# EAGLE design sensor_board012 (EAGLE 5.07)

## Sheet 1 of 2
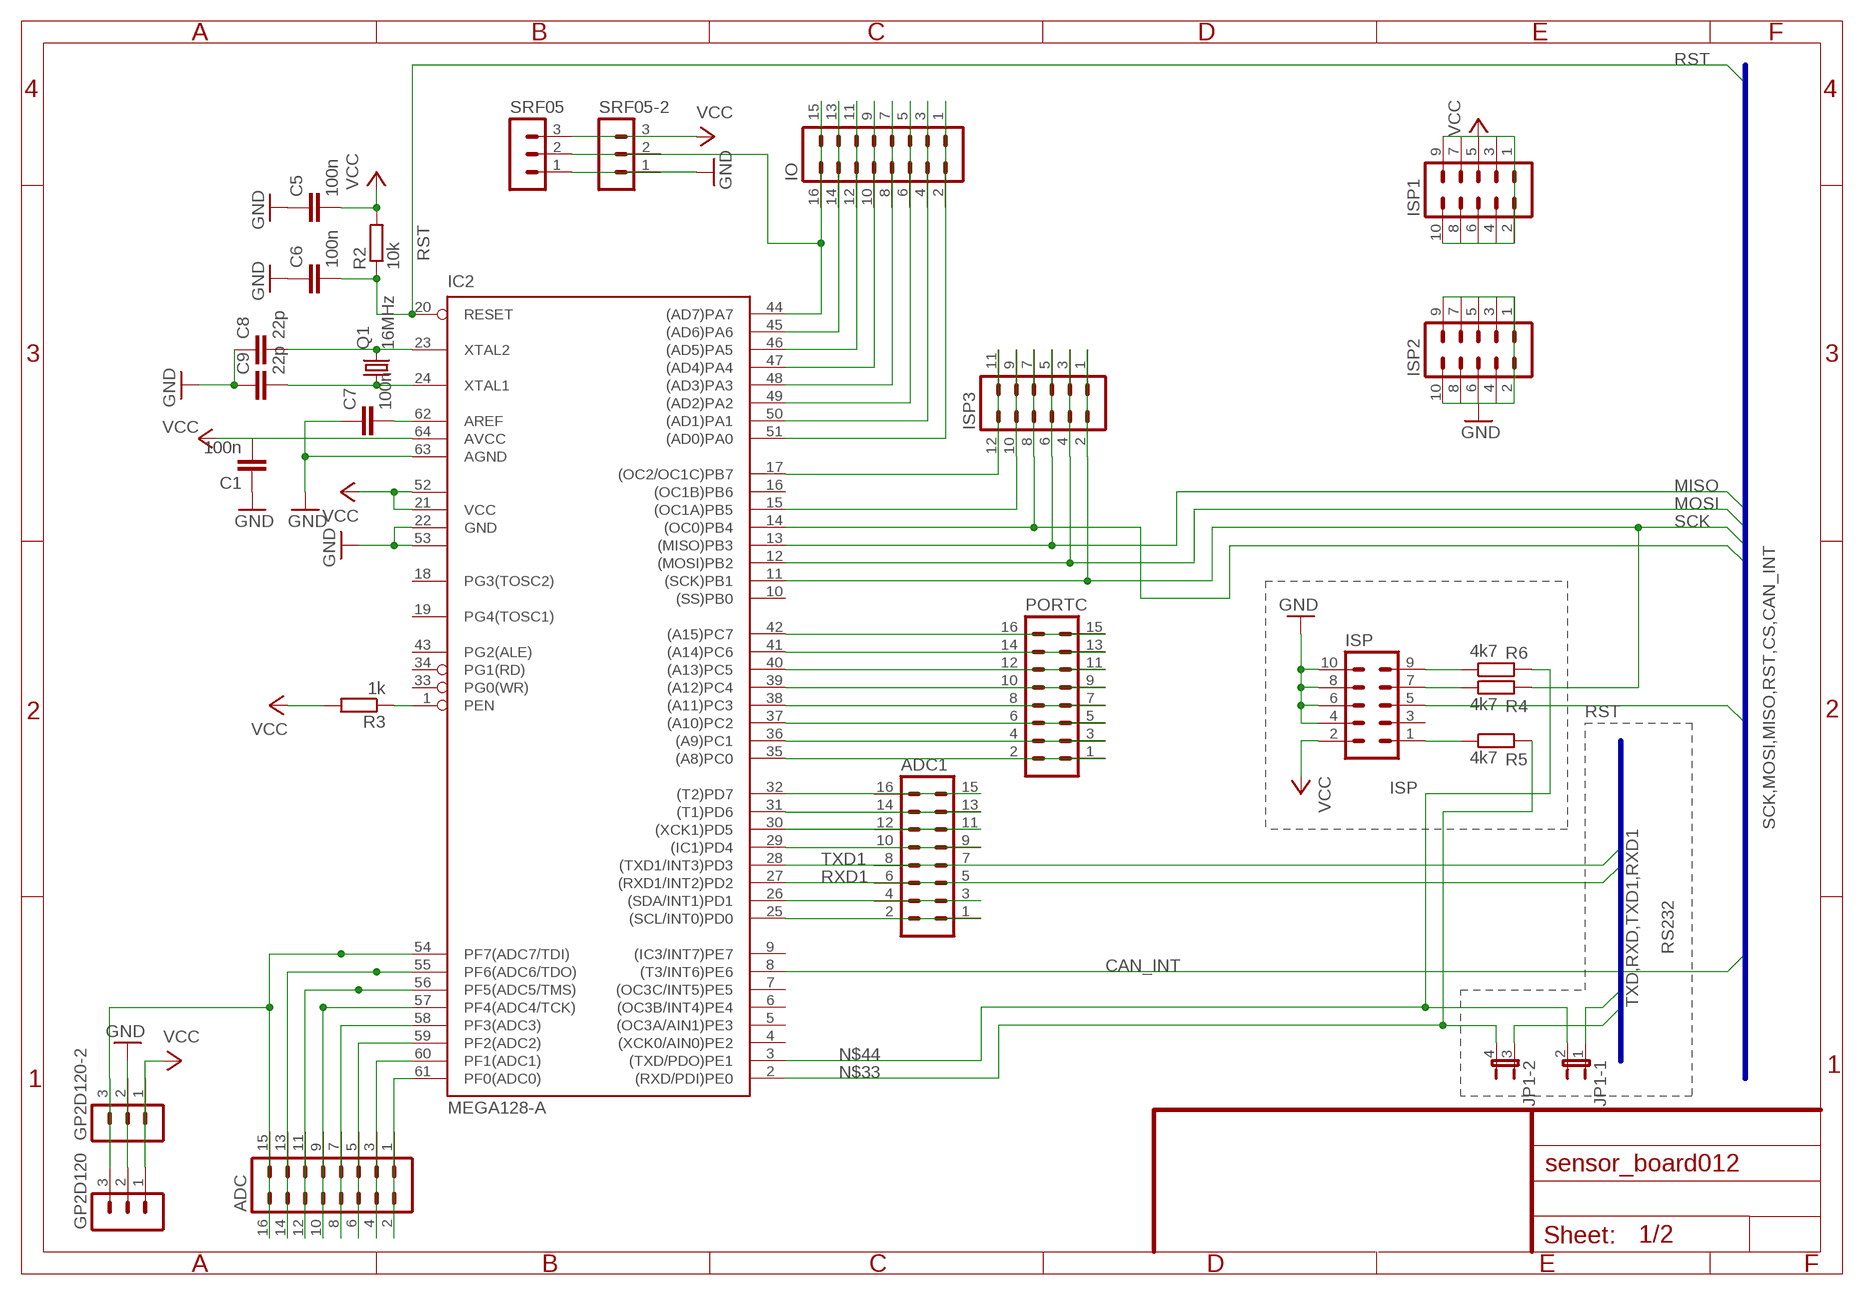
[diagram p0: schematic, sheet 1]

### Parts
ADC  MA08-2  [MA08-2]
ADC1  MA08-2  [MA08-2]
C1  100n  C-EUC0603  [C0603]
C5  100n  C-EUC0603  [C0603]
C6  100n  C-EUC0603  [C0603]
C7  100n  C-EUC0603  [C0603]
C8  22p  C-EUC0603  [C0603]
C9  22p  C-EUC0603  [C0603]
GP2D120  MA03-1  [MA03-1]
GP2D120-2  MA03-1  [MA03-1]
IC2  MEGA128-A  [TQFP64]
IO  MA08-2  [MA08-2]
ISP  MA05-2  [MA05-2]
ISP1  MA05-2  [MA05-2]
ISP2  MA05-2  [MA05-2]
ISP3  MA06-2  [MA06-2]
JP1  JP2QE  [JP2Q]
PORTC  MA08-2  [MA08-2]
Q1  16MHz  CRYSTALHC49U-V  [HC49U-V]
R2  10k  R-EU_R0805  [R0805]
R3  1k  R-EU_R0805  [R0805]
R4  4k7  R-EU_R0805  [R0805]
R5  4k7  R-EU_R0805  [R0805]
R6  4k7  R-EU_R0805  [R0805]
SRF05  MA03-1  [MA03-1]
SRF05-2  MA03-1  [MA03-1]

### Nets
CAN_INT: IC2.8((T3/INT6)PE6) ; also sheet 2
CS: IC2.14((OC0)PB4) ISP3.7 ISP3.8 ; also sheet 2
GND: C1.1 C5.1 C6.1 C7.1 C8.1 C9.1 GP2D120-2.2 GP2D120.2 IC2.22(GND) IC2.53(GND1) IC2.63(AGND) ISP2.1 ISP2.2 ISP2.3 ISP2.4 ISP2.5 ISP2.6 ISP2.7 ISP2.8 ISP2.9 ISP2.10 ISP.4 ISP.6 ISP.8 ISP.10 SRF05-2.1 SRF05.1 ; also sheet 2
MISO: IC2.13((MISO)PB3) ISP3.5 ISP3.6 ; also sheet 2
MOSI: IC2.12((MOSI)PB2) ISP3.3 ISP3.4 ; also sheet 2
N$1: ADC.1 ADC.2 IC2.61(PF0(ADC0))
N$3: ADC.3 ADC.4 IC2.60(PF1(ADC1))
N$4: ADC.5 ADC.6 IC2.59(PF2(ADC2))
N$5: C7.2 IC2.62(AREF)
N$6: C9.2 IC2.24(XTAL1) Q1.1
N$7: C8.2 IC2.23(XTAL2) Q1.2
N$9: ADC.7 ADC.8 IC2.58(PF3(ADC3))
N$11: ADC.9 ADC.10 IC2.57(PF4(ADC4/TCK))
N$14: ADC.11 ADC.12 IC2.56(PF5(ADC5/TMS))
N$15: ADC.13 ADC.14 IC2.55(PF6(ADC6/TDO))
N$19: ADC.15 ADC.16 GP2D120-2.3 GP2D120.3 IC2.54(PF7(ADC7/TDI))
N$20: IC2.45((AD6)PA6) IO.13 IO.14
N$22: ISP.9 R6.1
N$24: IC2.46((AD5)PA5) IO.11 IO.12
N$25: ISP.1 R5.1
N$26: IC2.1(PEN) R3.1
N$28: IC2.47((AD4)PA4) IO.9 IO.10
N$29: ISP.7 R4.1
N$31: IC2.48((AD3)PA3) IO.7 IO.8
N$32: IC2.49((AD2)PA2) IO.5 IO.6
N$33: IC2.2((RXD/PDI)PE0) JP1.4 R5.2
N$34: IC2.50((AD1)PA1) IO.3 IO.4
N$35: IC2.51((AD0)PA0) IO.1 IO.2
N$42: IC2.42((A15)PC7) PORTC.15 PORTC.16
N$44: IC2.3((TXD/PDO)PE1) JP1.2 R6.2
N$47: IC2.44((AD7)PA7) IO.15 IO.16 SRF05-2.2 SRF05.2
N$52: IC2.17((OC2/OC1C)PB7) ISP3.11 ISP3.12
N$60: IC2.15((OC1A)PB5) ISP3.9 ISP3.10
N$61: ADC1.1 ADC1.2 IC2.25((SCL/INT0)PD0)
N$62: ADC1.3 ADC1.4 IC2.26((SDA/INT1)PD1)
N$63: ADC1.9 ADC1.10 IC2.29((IC1)PD4)
N$64: ADC1.11 ADC1.12 IC2.30((XCK1)PD5)
N$65: ADC1.13 ADC1.14 IC2.31((T1)PD6)
N$66: ADC1.15 ADC1.16 IC2.32((T2)PD7)
N$67: IC2.41((A14)PC6) PORTC.13 PORTC.14
N$68: IC2.40((A13)PC5) PORTC.11 PORTC.12
N$69: IC2.39((A12)PC4) PORTC.9 PORTC.10
N$70: IC2.38((A11)PC3) PORTC.7 PORTC.8
N$71: IC2.37((A10)PC2) PORTC.5 PORTC.6
N$72: IC2.36((A9)PC1) PORTC.3 PORTC.4
N$73: IC2.35((A8)PC0) PORTC.1 PORTC.2
RST: C6.2 IC2.20(RESET) ISP.5 R2.1 ; also sheet 2
RXD: JP1.3 ; also sheet 2
RXD1: ADC1.5 ADC1.6 IC2.27((RXD1/INT2)PD2) ; also sheet 2
SCK: IC2.11((SCK)PB1) ISP3.1 ISP3.2 R4.2 ; also sheet 2
TXD: JP1.1 ; also sheet 2
TXD1: ADC1.7 ADC1.8 IC2.28((TXD1/INT3)PD3) ; also sheet 2
VCC: C1.2 C5.2 GP2D120-2.1 GP2D120.1 IC2.21(VCC) IC2.52(VCC1) IC2.64(AVCC) ISP1.1 ISP1.2 ISP1.3 ISP1.4 ISP1.5 ISP1.6 ISP1.7 ISP1.8 ISP1.9 ISP1.10 ISP.2 R2.2 R3.2 SRF05-2.3 SRF05.3 ; also sheet 2
Unconnected: IC2.4((XCK0/AIN0)PE2) IC2.5((OC3A/AIN1)PE3) IC2.6((OC3B/INT4)PE4) IC2.7((OC3C/INT5)PE5) IC2.9((IC3/INT7)PE7) IC2.10((SS)PB0) IC2.16((OC1B)PB6) IC2.18(PG3(TOSC2)) IC2.19(PG4(TOSC1)) IC2.33(PG0(WR)) IC2.34(PG1(RD)) IC2.43(PG2(ALE)) ISP.3

### Buses
SCK,MOSI,MISO,RST,CS,CAN_INT
TXD,RXD,TXD1,RXD1

### Notes on the sheet
- ISP
- RS232

## Sheet 2 of 2
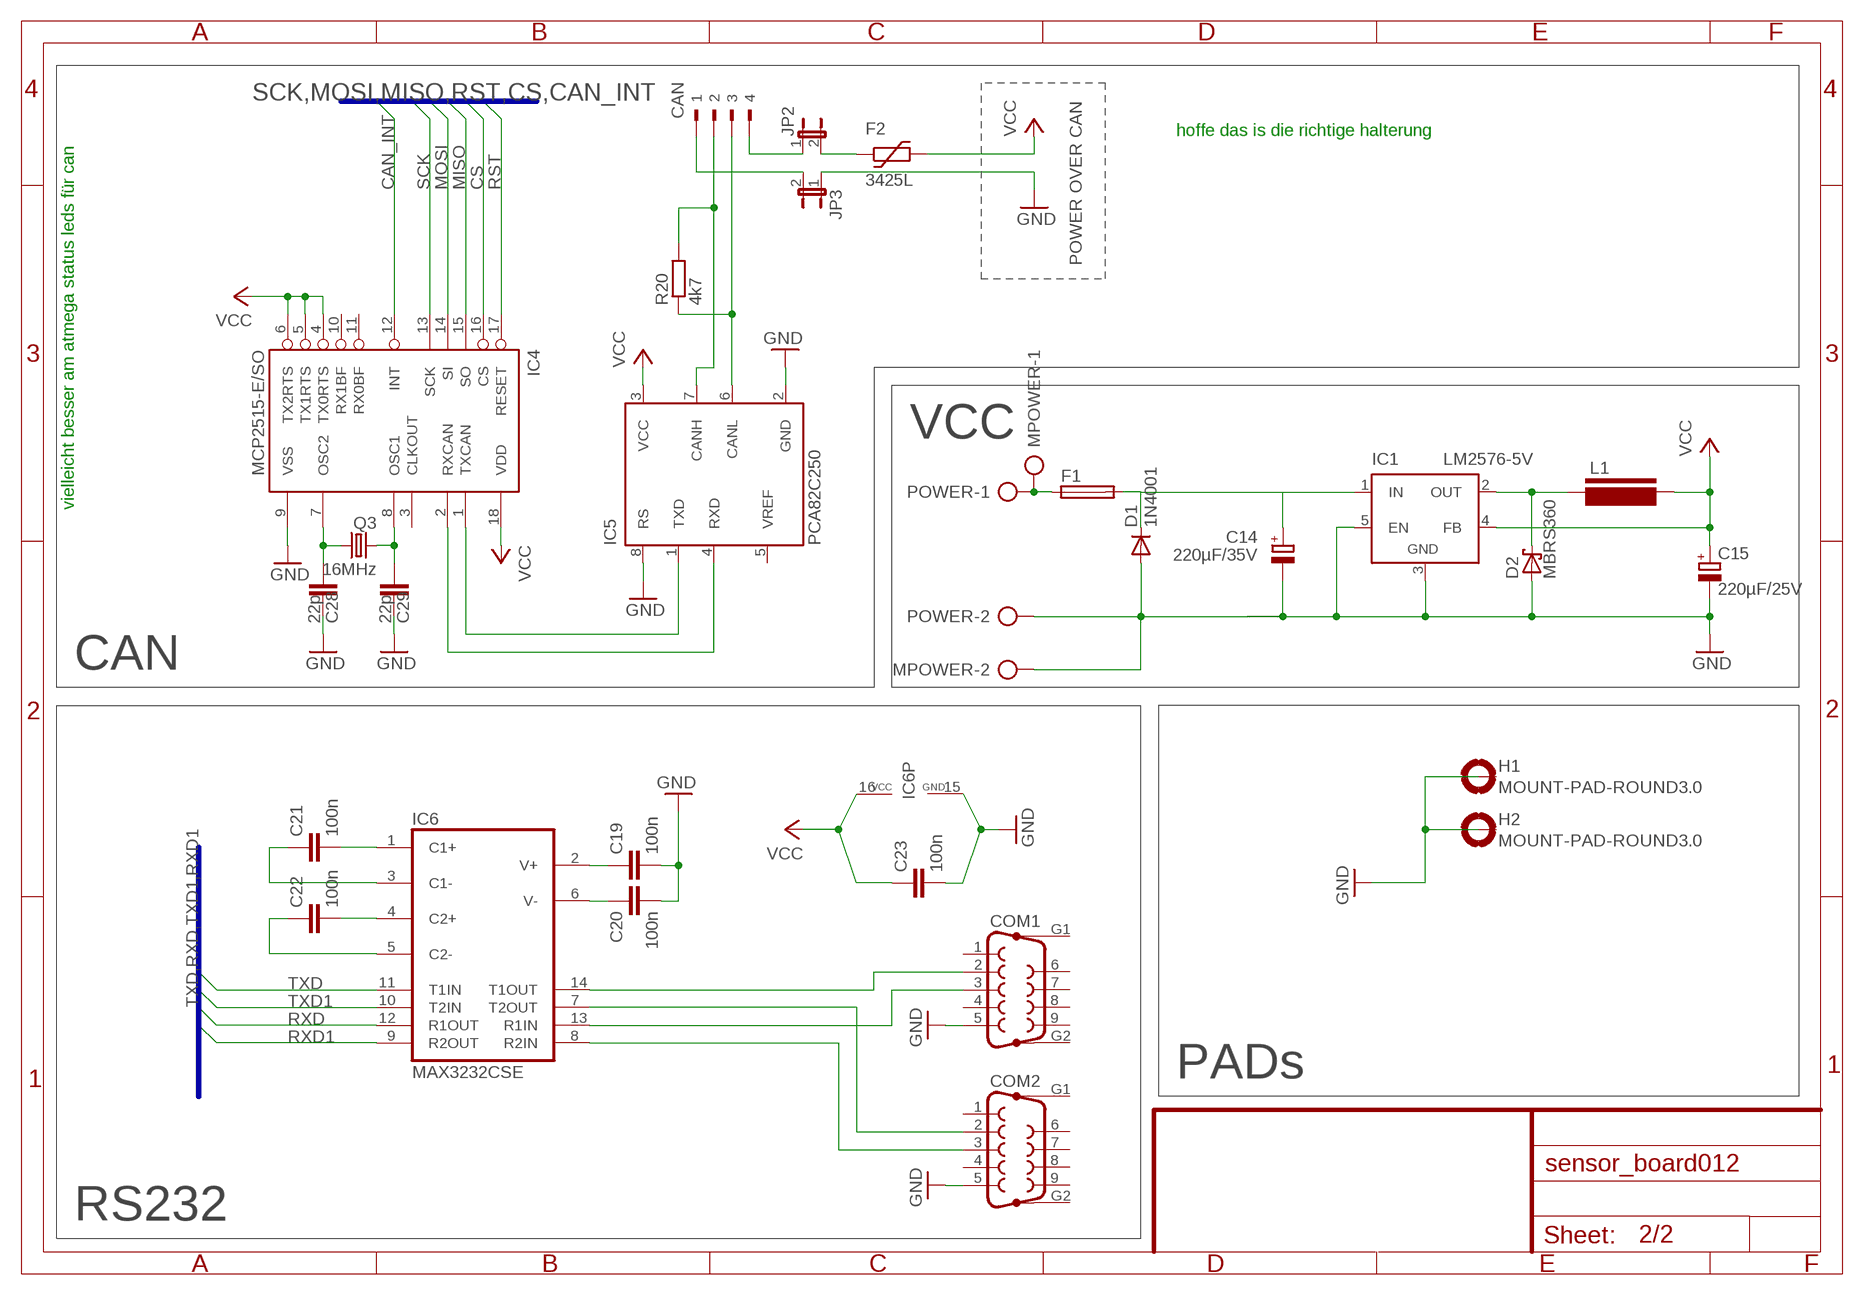
[diagram p1: schematic, sheet 2]

### Parts
C14  220µF/35V  CPOL-EUE5-10.5  [E5-10,5]
C15  220µF/25V  CPOL-EUE3.5-10  [E3,5-10]
C19  100n  C-EUC0603  [C0603]
C20  100n  C-EUC0603  [C0603]
C21  100n  C-EUC0603  [C0603]
C22  100n  C-EUC0603  [C0603]
C23  100n  C-EUC0603  [C0603]
C28  22p  C-EUC0603  [C0603]
C29  22p  C-EUC0603  [C0603]
CAN  90-4  [90-4]
COM1  F09HP  [F09HP]
COM2  F09HP  [F09HP]
D1  1N4001  1N4004  [DO41-10]
D2  MBRS360  SCHOTTKY-DIODESMC  [SMC]
F1  SH22,5A  [SH22,5A]
F2  3425L  [3425L]
H1  MOUNT-PAD-ROUND3.0  [3,0-PAD]
H2  MOUNT-PAD-ROUND3.0  [3,0-PAD]
IC1  LM2576-5V  LM2596TV  [TO220-51]
IC4  MCP2515-E/SO  [SO18L]
IC5  PCA82C250  [DIL08]
IC6  MAX3232CSE  [SO16]
JP2  JP1E  [JP1]
JP3  JP1E  [JP1]
L1  L-PISR  [PISR]
MPOWER  AK500/2-H  [AK500/2-H]
POWER  AK500/2-H  [AK500/2-H]
Q3  16MHz  CRYSTALHC49U-V  [HC49U-V]
R20  4k7  R-EU_R0805  [R0805]

### Nets
CAN_INT: IC4.12(INT) ; also sheet 1
CS: IC4.16(CS) ; also sheet 1
GND: C14.- C15.- C19.2 C20.2 C23.2 C28.2 C29.2 COM1.5 COM2.5 D1.A D2.A H1.B3,0(MOUNT) H2.B3,0(MOUNT) IC1.3(GND) IC1.5(EN) IC4.9(VSS) IC5.2(GND) IC5.8(RS) IC6.15(GND) JP3.1 MPOWER.2 POWER.2 ; also sheet 1
MISO: IC4.15(SO) ; also sheet 1
MOSI: IC4.14(SI) ; also sheet 1
N$2: IC4.1(TXCAN) IC5.1(TXD)
N$8 [Power]: D2.C IC1.2(OUT) L1.P$1
N$10 [Power]: F1.1 MPOWER.1 POWER.1
N$12: COM1.2 IC6.14(T1OUT)
N$13: COM1.3 IC6.13(R1IN)
N$16: CAN.4 JP2.1
N$17: C21.2 IC6.1(C1+)
N$21: IC4.2(RXCAN) IC5.4(RXD)
N$23: CAN.3 IC5.6(CANL) R20.1
N$30: C22.2 IC6.4(C2+)
N$36: C22.1 IC6.5(C2-)
N$37: C21.1 IC6.3(C1-)
N$40: COM2.2 IC6.7(T2OUT)
N$41: COM2.3 IC6.8(R2IN)
N$43: C19.1 IC6.2(V+)
N$46: C20.1 IC6.6(V-)
N$49: F2.P$1 JP2.2
N$50: CAN.1 JP3.2
N$53: C28.1 IC4.7(OSC2) Q3.1
N$54: C29.1 IC4.8(OSC1) Q3.2
N$56 [Power]: C14.+ D1.C F1.2 IC1.1(IN)
N$59: CAN.2 IC5.7(CANH) R20.2
RST: IC4.17(RESET) ; also sheet 1
RXD: IC6.12(R1OUT) ; also sheet 1
RXD1: IC6.9(R2OUT) ; also sheet 1
SCK: IC4.13(SCK) ; also sheet 1
TXD: IC6.11(T1IN) ; also sheet 1
TXD1: IC6.10(T2IN) ; also sheet 1
VCC: C15.+ C23.1 F2.P$2 IC1.4(FB) IC4.4(TX0RTS) IC4.5(TX1RTS) IC4.6(TX2RTS) IC4.18(VDD) IC5.3(VCC) IC6.16(VCC) L1.P$2 ; also sheet 1
Unconnected: COM1.1 COM1.4 COM1.6 COM1.7 COM1.8 COM1.9 COM1.G1 COM1.G2 COM2.1 COM2.4 COM2.6 COM2.7 COM2.8 COM2.9 COM2.G1 COM2.G2 IC4.3(CLKOUT) IC4.10(RX1BF) IC4.11(RX0BF) IC5.5(VREF)

### Buses
SCK,MOSI,MISO,RST,CS,CAN_INT
TXD,RXD,TXD1,RXD1

### Notes on the sheet
- POWER OVER CAN
- hoffe das is die richtige halterung
- VCC
- vielleicht besser am atmega status leds für can
- CAN
- PADs
- RS232

## Library data of the parts
ADC ADC1 IO PORTC = con-lstb:MA08-2: PIN HEADER
C1 C5-C9 C19-C23 C28 C29 = rcl:C-EU: CAPACITOR, European symbol
C14 C15 = rcl:CPOL-EU: POLARIZED CAPACITOR, European symbol
CAN = con-weidmueller-sl35:90-4: WEIDMUELLER CLAMP CONNECTOR
COM1 COM2 = con-subd:F09HP: SUB-D
D1 = diode:1N4004: DIODE general purpose rectifier, 1 A
D2 = diode:SCHOTTKY-DIODE: Schottky Diode
F1 = fuse:SH22,5A: FUSE HOLDER grid 22,5mm, isolated cap OGN0031 8201, Schurter (Buerklin)
F2 = ptc-littlefuse:3425L
GP2D120 GP2D120-2 SRF05 SRF05-2 = con-lstb:MA03-1: PIN HEADER
H1 H2 = holes:MOUNT-PAD-ROUND: MOUNTING PAD, round
IC1 = linear:LM2596T: STEP-DOWN VOLTAGE REGULATOR
IC2 = atmel:MEGA128: MICROCONTROLLER 128 Kbytes FLASH 4 Kbytes SRAM 4 Kbytes EEPROM DUAL USART 8-channel 10 bit ADC Source: avr.lbr
IC4 = mcp2515:MCP2515
IC5 = micro-philips:PCA82C250: CAN CONTROLLER INTERFACE
IC6 = maxim:MAX3232*: True RS-232 Transceivers 3.0V to 5.5V, Low-Power up to 1Mbps, Using Four 0.1µF External Capacitors Source: http://pdfserv.maxim-ic.com/en/ds/MAX3222-MAX3241.pdf
ISP ISP1 ISP2 = con-lstb:MA05-2: PIN HEADER
ISP3 = con-lstb:MA06-2: PIN HEADER
JP1 = jumper:JP2QE: JUMPER
JP2 JP3 = jumper:JP1E: JUMPER
L1 = L-PISR:L-PISR: Fastron SMD Power Inductors (also Shielded) - PISR Series Data Sheet <http://www.fastrongroup.com/products/inductors/pdf/PISR.pdf> Part No Inductance L (µH) fL (MHz) Tol ± (%) SRF min (MHz) DCR max (Ω) Rated DC Current | sat (A) | Δ T = 40°C (A) PISR-1R0M-04 1.0 0.1 20 164 0.009 21 8.60 PISR-2R2M-04 2.2 0.1 20 95 0.014 16 7.10 PISR-3R3M-04 3.3 0.1 20 72 0.017 15 6.40 PISR-4R7M-04 4.7 0.1 20 52 0.019 13 5.80 PISR-5R6M-04 5.6 0.1 20 41 0.022 12 5.50 PISR-6R8M-04 6.8 0.1 20 35 0.024 11 5.20 PISR-100M-04 10 0.1 20 24 0.029 10 4.50 PISR-150M-04 15 0.1 20 20 0.035 8.0 4.10 PISR-220M-04 22 0.1 20 15 0.04 7.0 3.60 PISR-330M-04 33 0.1 20 10 0.06 5.6 3.10 PISR-470M-04 47 0.1 20 8 0.07 4.6 2.70 PISR-680M-04 68 0.1 20 6.5 0.10 3.6 2.30 PISR-101M-04 100 0.1 20 5.2 0.17 3.1 1.90 PISR-151M-04 150 0.1 20 4.2 0.22 2.6 1.60 PISR-221M-04 220 0.1 20 3.3 0.34 2.2 1.30 PISR-331M-04 330 0.1 20 2.7 0.52 1.9 1.10 PISR-471M-04 470 0.1 20 2.1 0.76 1.4 0.85 PISR-681M-04 680 0.1 20 1.8 1.1 1.2 0.74 PISR-102M-04 1000 0.1 20 1.3 1.7 1.0 0.57
MPOWER POWER = con-ptr500:AK500/2-H: CONNECTOR Aug. 2004 / PTR Meßtechnik: Die Bezeichnung der Serie AK505 wurde geändert. Es handelt sich hierbei um AK500 in horizontaler Ausführung.
Q1 Q3 = crystal:CRYSTAL: CRYSTAL
R2-R6 R20 = rcl:R-EU_: RESISTOR, European symbol

## Net classes
1 Power: width 0.406 mm

## Board
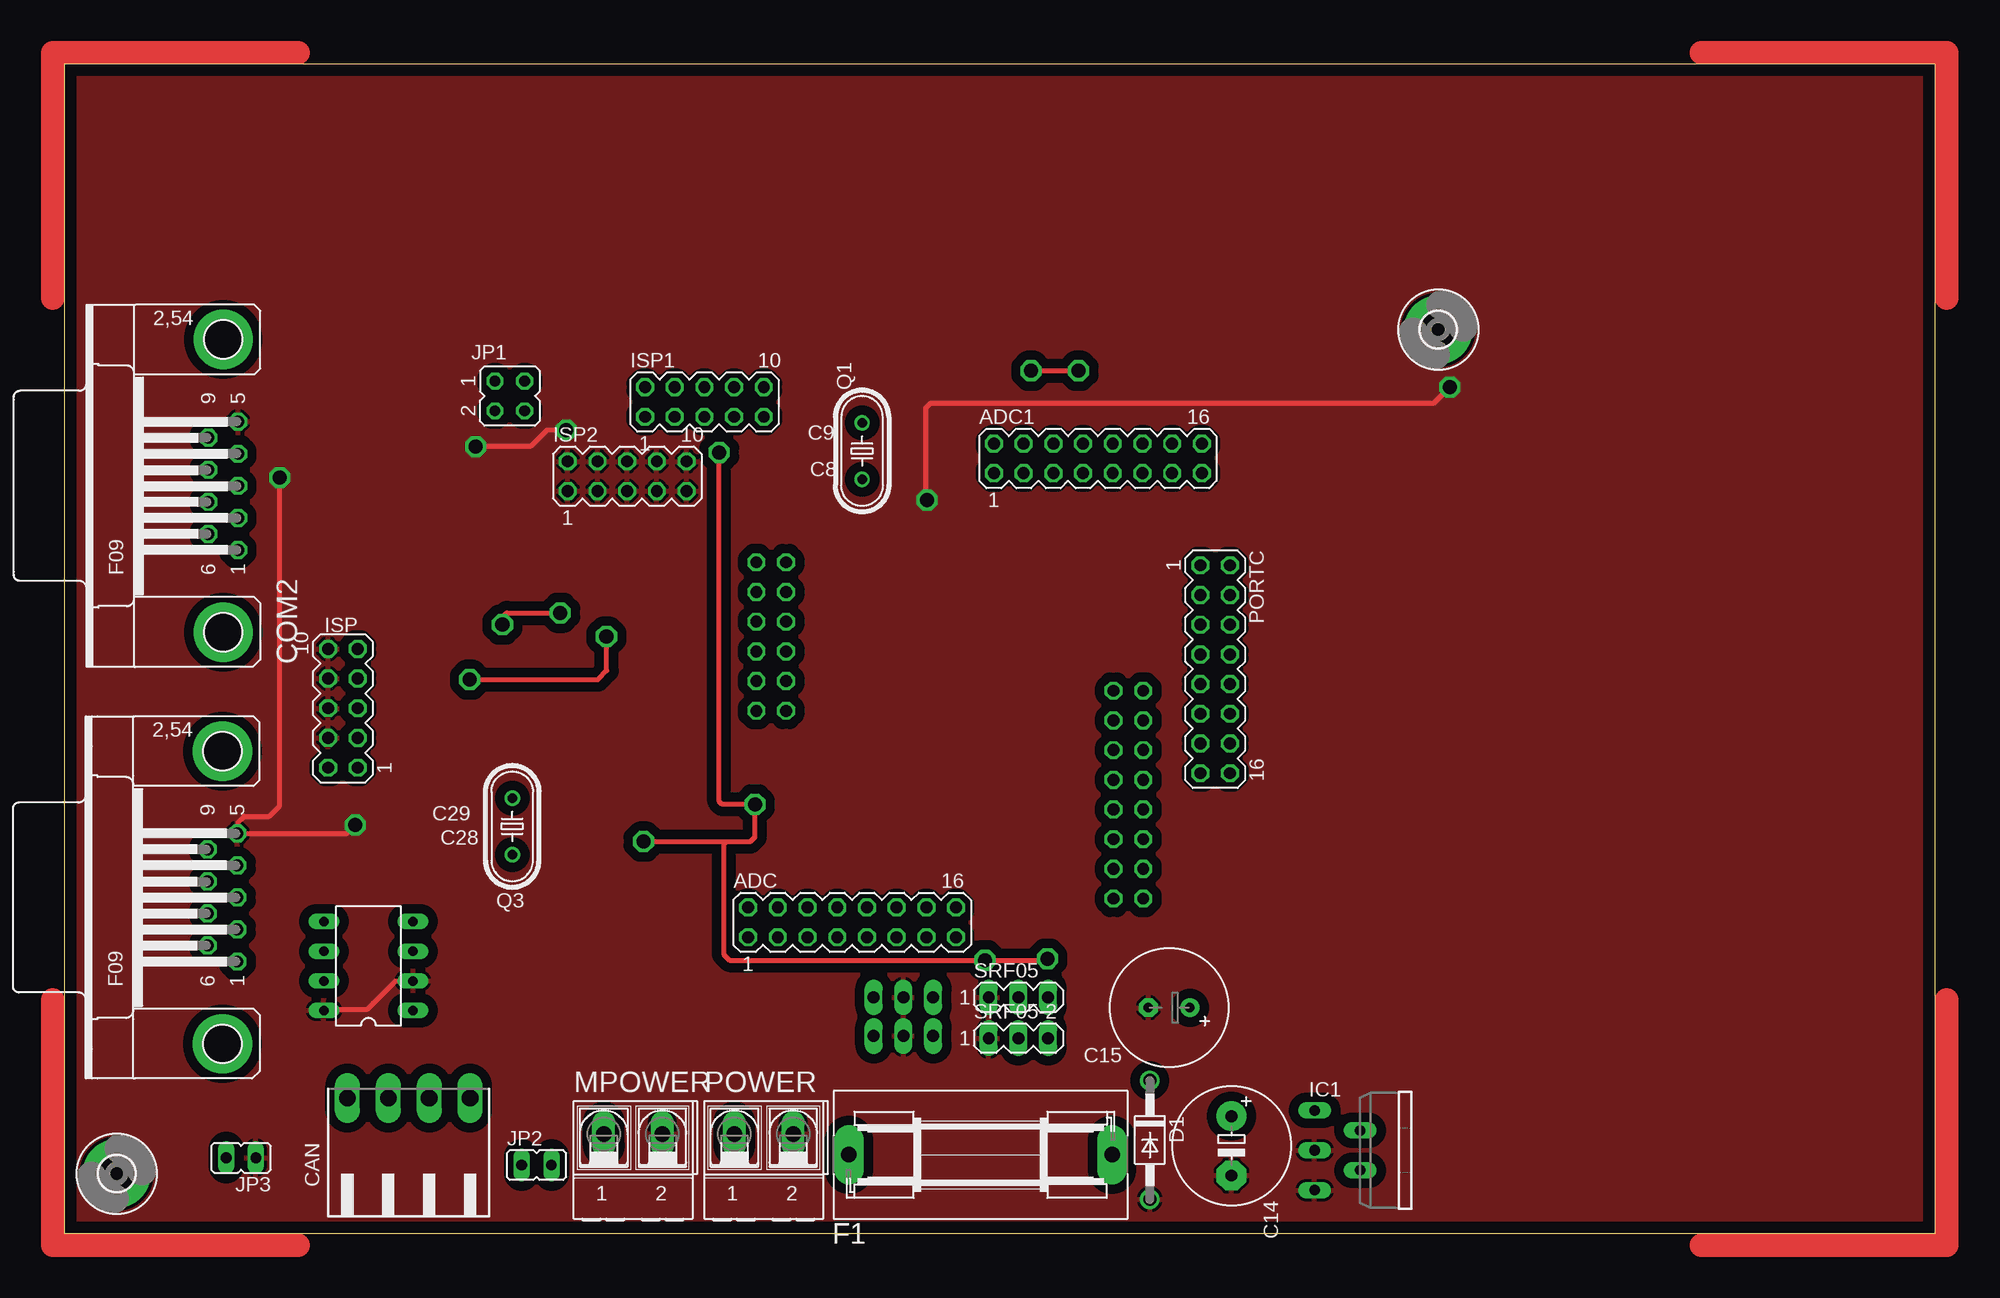
[diagram p2: board, top side]
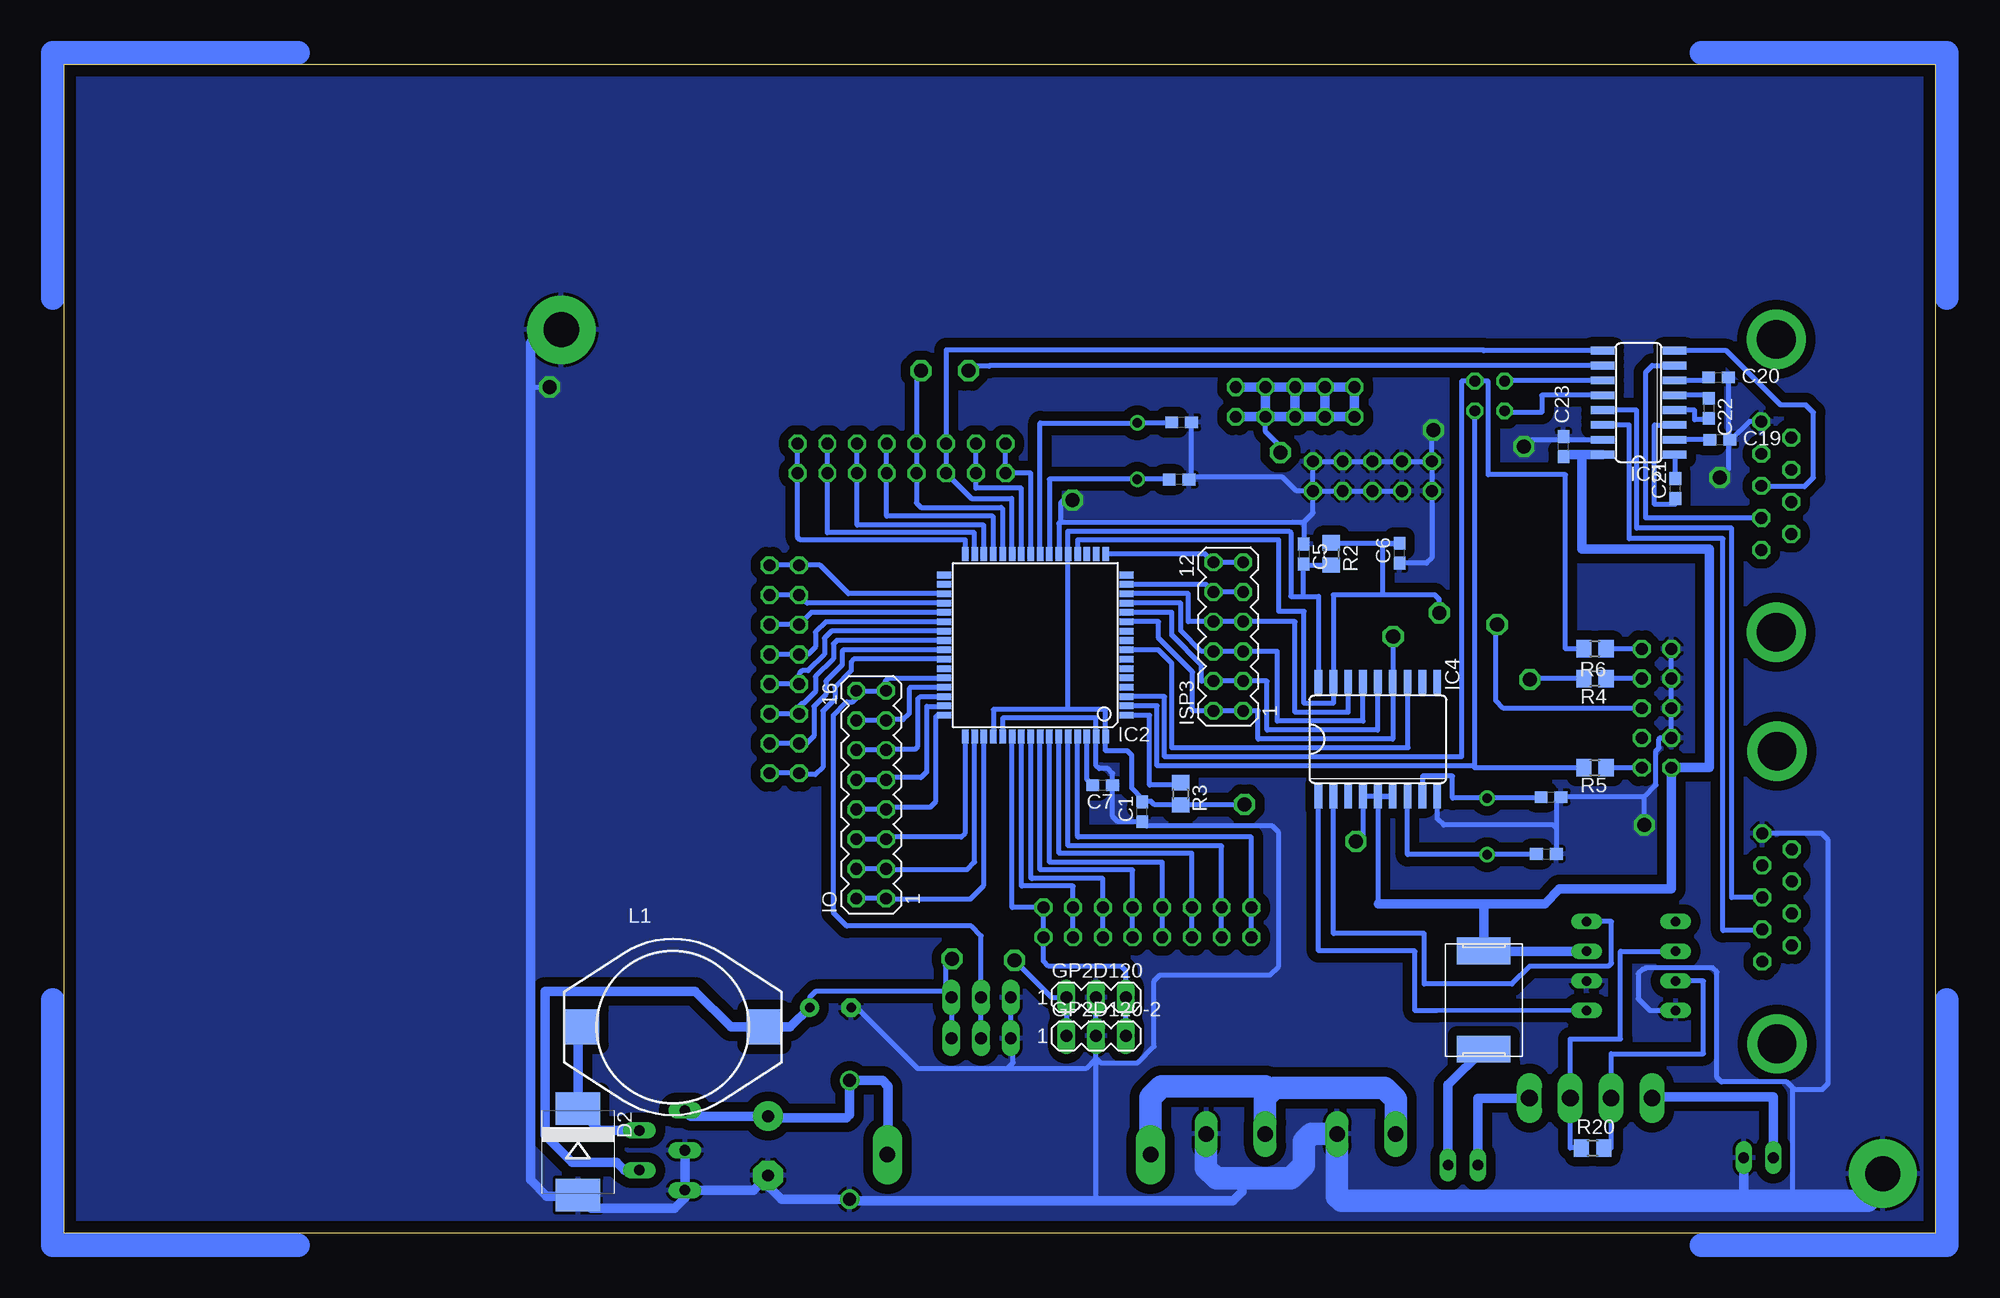
[diagram p3: board, bottom side, seen from below]

Size 160 x 100 mm. Coordinates in mm from the lower left corner, seen from the top.
Outline: 0,0 160,0 160,100 0,100 0,0
Copper layers (1*16): Top 0.035mm / dielectric 1.5mm / Bottom 0.035mm
Design rules "default": minimum track width 10mil, minimum drill 24mil, track to track 8mil, track to pad 8mil, pad to pad 8mil, via to via 8mil, smd to smd 8mil, copper to edge 40mil, drill to drill 8mil, minimum pad ring 10mil, minimum via ring 8mil, stop-mask expansion 4mil, vias tented up to drill 0mil, thermal gap 10mil

### Footprints (pad centres in the part's own frame; a part is rotated, then mirrored left to right if it is on the bottom)
MA08-2 = drill 1.016 octagon: 1 -8.89,-1.27; 2 -8.89,1.27; 3 -6.35,-1.27; 4 -6.35,1.27; 5 -3.81,-1.27; 6 -3.81,1.27; 7 -1.27,-1.27; 8 -1.27,1.27; 9 1.27,-1.27; 10 1.27,1.27; 11 3.81,-1.27; 12 3.81,1.27; 13 6.35,-1.27; 14 6.35,1.27; 15 8.89,-1.27; 16 8.89,1.27
C0603 = smd 1.1 x 1: 1 -0.85,0; 2 0.85,0
E5-10,5 = drill 1.016 pad 2.54 round: + -2.54,0 | drill 1.016 pad 2.54 octagon: - 2.54,0
E3,5-10 = drill 0.813 pad 1.6 round: + -1.778,0 | drill 0.813 pad 1.6 octagon: - 1.778,0
90-4 = drill 1.422 long: 1 -5.25,5.25; 2 -1.75,5.25; 3 1.75,5.25; 4 5.25,5.25
F09HP = drill 1.016 octagon: 1 -5.486,-1.27; 2 -2.743,-1.27; 3 0,-1.27; 4 2.743,-1.27; 5 5.486,-1.27; 6 -4.115,1.27; 7 -1.372,1.27; 8 1.372,1.27; 9 4.115,1.27 | drill 3.302 pad 5.08 round: G1 -12.522,0; G2 12.522,0
DO41-10 = drill 1.118 round: A 5.08,0; C -5.08,0
SMC = smd 2.8 x 3.8: A 3.7,0; C -3.7,0
SH22,5A = drill 1.321 pad 2.54 long: 1 -11.252,0; 2 11.252,0
3425L = smd 2.29 x 4.57: P$1 -4.2,0; P$2 4.2,0
MA03-1 = drill 1.016 long: 1 -2.54,0; 2 0,0; 3 2.54,0
3,0-PAD = drill 3 pad 5.842 round: B3,0 0,0
TO220-51 = drill 0.9 long: 1 -3.4,-8.4; 2 -1.7,-4.5; 3 0,-8.4; 4 1.7,-4.5; 5 3.4,-8.4
TQFP64 = smd 1.194 x 0.559: 1 -7.8,6; 2 -7.8,5.2; 3 -7.8,4.4; 4 -7.8,3.6; 5 -7.8,2.8; 6 -7.8,2; 7 -7.8,1.2; 8 -7.8,0.4; 9 -7.8,-0.4; 10 -7.8,-1.2; 11 -7.8,-2; 12 -7.8,-2.8; 13 -7.8,-3.6; 14 -7.8,-4.4; 15 -7.8,-5.2; 16 -7.8,-6; 33 7.8,-6; 34 7.8,-5.2; 35 7.8,-4.4; 36 7.8,-3.6; 37 7.8,-2.8; 38 7.8,-2; 39 7.8,-1.2; 40 7.8,-0.4; 41 7.8,0.4; 42 7.8,1.2; 43 7.8,2; 44 7.8,2.8; 45 7.8,3.6; 46 7.8,4.4; 47 7.8,5.2; 48 7.8,6 | smd 0.559 x 1.194: 17 -6,-7.8; 18 -5.2,-7.8; 19 -4.4,-7.8; 20 -3.6,-7.8; 21 -2.8,-7.8; 22 -2,-7.8; 23 -1.2,-7.8; 24 -0.4,-7.8; 25 0.4,-7.8; 26 1.2,-7.8; 27 2,-7.8; 28 2.8,-7.8; 29 3.6,-7.8; 30 4.4,-7.8; 31 5.2,-7.8; 32 6,-7.8; 49 6,7.8; 50 5.2,7.8; 51 4.4,7.8; 52 3.6,7.8; 53 2.8,7.8; 54 2,7.8; 55 1.2,7.8; 56 0.4,7.8; 57 -0.4,7.8; 58 -1.2,7.8; 59 -2,7.8; 60 -2.8,7.8; 61 -3.6,7.8; 62 -4.4,7.8; 63 -5.2,7.8; 64 -6,7.8
SO18L = smd 0.66 x 2.032: 1 -5.08,-4.902; 2 -3.81,-4.902; 3 -2.54,-4.902; 4 -1.27,-4.902; 5 0,-4.902; 6 1.27,-4.902; 7 2.54,-4.902; 8 3.81,-4.902; 9 5.08,-4.902; 10 5.08,4.902; 11 3.81,4.902; 12 2.54,4.902; 13 1.27,4.902; 14 0,4.902; 15 -1.27,4.902; 16 -2.54,4.902; 17 -3.81,4.902; 18 -5.08,4.902
DIL08 = drill 0.813 long: 1 -3.81,-3.81; 2 -1.27,-3.81; 3 1.27,-3.81; 4 3.81,-3.81; 5 3.81,3.81; 6 1.27,3.81; 7 -1.27,3.81; 8 -3.81,3.81
SO16 = smd 0.66 x 2.032: 1 -4.445,-3.073; 2 -3.175,-3.073; 3 -1.905,-3.073; 4 -0.635,-3.073; 5 0.635,-3.073; 6 1.905,-3.073; 7 3.175,-3.073; 8 4.445,-3.073; 9 4.445,3.073; 10 3.175,3.073; 11 1.905,3.073; 12 0.635,3.073; 13 -0.635,3.073; 14 -1.905,3.073; 15 -3.175,3.073; 16 -4.445,3.073
MA05-2 = drill 1.016 octagon: 1 -5.08,-1.27; 2 -5.08,1.27; 3 -2.54,-1.27; 4 -2.54,1.27; 5 0,-1.27; 6 0,1.27; 7 2.54,-1.27; 8 2.54,1.27; 9 5.08,-1.27; 10 5.08,1.27
MA06-2 = drill 1.016 octagon: 1 -6.35,-1.27; 2 -6.35,1.27; 3 -3.81,-1.27; 4 -3.81,1.27; 5 -1.27,-1.27; 6 -1.27,1.27; 7 1.27,-1.27; 8 1.27,1.27; 9 3.81,-1.27; 10 3.81,1.27; 11 6.35,-1.27; 12 6.35,1.27
JP2Q = drill 0.914 octagon: 1 -1.27,-1.27; 2 -1.27,1.27; 3 1.27,-1.27; 4 1.27,1.27
JP1 = drill 0.914 long: 1 0,-1.27; 2 0,1.27
PISR = smd 3 x 3: P$1 -7.8,0; P$2 7.8,0
AK500/2-H = drill 1.321 long: 1 -2.515,0; 2 2.515,0
HC49U-V = drill 0.813 round: 1 -2.413,0; 2 2.413,0
R0805 = smd 1.3 x 1.5: 1 -0.95,0; 2 0.95,0

### Placement (x,y rotation side)
ADC  67.37,26.61 0 top
ADC1  88.39,66.29 0 top
C1  67.82,36.07 90 bottom
C5  54,58.12 270 bottom
C6  45.81,58.18 90 bottom
C7  71.2,38.33 180 bottom
C8  64.66,64.48 180 bottom
C9  64.44,69.38 180 bottom
C14  99.82,7.49 270 top
C15  94.49,19.3 180 top
C19  18.41,67.88 0 bottom
C20  18.53,73.22 0 bottom
C21  22.23,63.72 90 bottom
C22  19.37,70.57 270 bottom
C23  31.79,67.31 90 bottom
C28  33.25,32.46 0 bottom
C29  32.85,37.33 0 bottom
CAN  29.45,6.32 0 top
COM1  13.53,28.74 90 top
COM2  13.59,63.94 90 top
D1  92.84,8 270 top
D2  116.08,6.99 270 bottom
F1  78.36,6.73 0 top
F2  38.61,19.96 90 bottom
GP2D120  71.75,20.19 0 bottom
GP2D120-2  71.75,16.89 0 bottom
H1  4.48,5.12 0 top
H2  117.5,77.29 0 top
IC1  115.32,7.11 270 top
IC2  76.95,50.32 180 bottom
IC4  47.66,42.28 0 bottom
IC5  26.01,22.87 90 top
IC6  25.36,71.06 90 bottom
IO  91,37.53 90 bottom
ISP  23.83,44.92 90 top
ISP1  54.74,71.12 0 top
ISP2  48.13,64.77 0 top
ISP3  60.45,51.05 90 bottom
JP1  38.1,71.63 270 top
JP2  40.39,5.84 270 top
JP3  15.11,6.48 90 top
L1  107.95,17.65 0 bottom
MPOWER  48.64,8.51 0 top
PORTC  98.42,48.26 270 top
POWER  59.82,8.51 0 top
Q1  68.22,66.92 270 top
Q3  38.3,34.82 90 top
R2  51.65,58.12 270 bottom
R3  64.54,37.6 270 bottom
R4  29.1,47.45 180 bottom
R5  29.1,39.83 180 bottom
R6  29.1,50 180 bottom
R20  29.3,7.32 0 bottom
SRF05  81.6,20.19 0 top
SRF05-2  81.6,16.7 0 top

### Tracks (layer width: path | path; a pad name or v marks a point on that pad's centre or on a via)
CAN_INT
  Bottom 0.406: IC2.8 66.43,49.92 65.28,48.77 65.28,41.53 45.09,41.53 45.09,47.18 IC4.12
CS
  Bottom 0.406: IC2.14 63.88,54.72 63.88,52.32 ISP3.8 ISP3.7 54.74,52.32 54.74,44.58 50.2,44.58 IC4.16
GND  (via drill 1.2)
  Top 0.406: IC5.2 28.33,21.6 25.91,19.18 22.31,19.18 IC5.8 | 118.62,72.39 118.56,72.45 v118.49,72.39 117.09,70.99 74.04,70.99 73.66,70.61 73.66,62.74 v73.79,62.74 | v24.89,34.92 24.19,34.23 COM1.5 14.86,34.29 14.86,35.18 15.37,35.69 17.53,35.69 18.41,36.58 v18.41,64.64 | v35.18,67.31 39.88,67.31 41.27,68.71 v42.93,68.71
  Bottom 0.406: C20.2 17.65,73.22 17.65,67.88 | 17.65,67.88 C19.2 17.46,67.88 15.88,69.47 14.9,69.47 COM2.5 | C23.2 31.75,68.16 31.75,67.88 | 31.75,67.88 IC6.15 | GP2D120.2 GP2D120-2.2 71.75,14.99 | 54,60.83 C5.1 | 74.8,60.83 54,60.83 | 74.8,60.83 arc-90 74.95,60.69 IC2.22 | IC2.53 79.76,44.07 71.75,44.07 IC2.63 71.75,40.01 71.5,39.75 70.74,39.75 70.35,39.36 C7.1 70.36,38.32 70.36,35.69 69.89,35.22 C1.1 67.44,34.84 56.68,34.84 56.13,34.29 56.13,22.86 56.9,22.1 66.29,22.1 66.8,21.59 66.8,16 68.2,14.61 71.37,14.61 71.75,14.99 | C15.- 92.2,19.3 87,14.1 79.38,14.1 | 79.38,14.1 78.87,14.61 78.87,16.51 SRF05-2.1 SRF05.1 | IC5.8 24.4,19.06 25.4,20.07 25.4,22.23 25.02,22.61 24.89,22.61 24.77,22.73 19.05,22.73 18.67,22.35 18.67,13.34 18.29,12.95 12.7,12.95 12.19,12.45 | 12.19,12.45 12.19,2.92 12.32,2.79 | 32.4,34.67 32.4,36.93 C29.2 24.89,37.34 | 32.4,34.67 C28.2 | 71.75,14.99 72.64,14.1 79.38,14.1 | 71.75,14.99 71.75,3.17 72.14,2.79 | 63.59,64.69 C9.1 | 63.59,64.69 C8.1 | ISP2.2 ISP2.1 43.05,57.78 43.51,57.33 C6.1 | ISP2.2 ISP2.4 ISP2.6 ISP2.8 ISP2.10 ISP2.9 | ISP2.9 ISP2.7 ISP2.5 ISP2.3 | ISP2.9 53.21,61.62 54,60.83 | 63.59,64.69 55.8,64.69 54.61,63.5 ISP2.9 | 74.8,60.83 74.8,62.48 74.55,62.74 v73.79,62.74 | v118.49,72.39 120.02,72.39 120.14,72.52 | ISP.10 ISP.8 ISP.6 ISP.4 23.53,42.38 23.62,42.29 23.62,41.53 23.88,41.27 23.88,38.35 24.89,37.34 | COM1.5 9.72,34.23 9.14,33.66 9.14,12.83 9.65,12.32 12.06,12.32 12.19,12.45 | v24.89,34.92 24.89,37.34 | 31.75,67.88 34.61,67.88 v35.18,67.31 | ISP2.2 43.05,68.58 v42.93,68.71 | 17.65,67.88 17.65,65.41 v18.41,64.64 | IC4.9 42.58,35.47 42.04,34.92 32.65,34.92 32.4,34.67
  Bottom 0.406: 92.84,2.79 D1.A
  Bottom 0.813: JP3.1 16.38,3.05 16.13,2.79 | D1.A 98.68,2.92 99.69,3.94 99.69,4.83 C14.- 101.06,3.71 IC1.5 | 92.84,2.79 72.14,2.79 60.07,2.79 59.31,3.56 59.31,4.19 | 59.31,4.19 59.18,4.32 | 59.31,4.19 60.58,4.19 61.09,4.7 | IC1.5 IC1.3 | IC1.5 106.92,3.07 107.82,2.16 114.95,2.16 D2.A 116.98,3.29 117.09,3.17 118.75,3.17 120.14,4.57 120.14,72.52 120.14,76.2 119.25,77.09 117.73,77.09 117.52,77.29 H2.B3,0
  Bottom 1.93: POWER.2 62.36,8.48 62.36,5.59 61.47,4.7 61.09,4.7 55.12,4.7 53.98,5.84 53.98,7.87 53.34,8.51 MPOWER.2 51.16,3.15 50.8,2.79 16.13,2.79 12.32,2.79 5.79,2.79 H1.B3,0
  pour Bottom (isolate 0.813): -0.25,100.08 160.02,100.08 160.15,0 -0.13,-0.25
  pour Top (isolate 0.813): -0.13,100.08 160.15,100.08 160.15,0 -0.13,-0.25
MISO
  Bottom 0.406: IC2.13 64.52,53.92 64.52,51.56 62.74,49.78 ISP3.6 ISP3.5 56.26,49.78 56.26,43.81 48.93,43.81 IC4.15
MOSI
  Bottom 0.406: IC2.12 65.28,53.12 65.28,51.18 62.74,48.64 62.74,47.24 ISP3.4 ISP3.3 57.15,47.24 57.15,43.05 47.66,43.05 IC4.14
N$1
  Bottom 0.406: IC2.61 73.35,33.98 arc-90 73.28,33.91 58.48,33.91 ADC.2 ADC.1
N$2
  Bottom 0.406: IC5.1 42.65,19.05 44.49,19.05 44.49,24.09 44.58,24.18 52.74,24.18 IC4.1
N$3
  Bottom 0.406: IC2.60 74.15,33.15 61.09,33.15 arc90 61.02,33.08 ADC.4 ADC.3
N$4
  Bottom 0.406: IC2.59 74.93,42.52 74.93,32.51 63.56,32.51 ADC.6 ADC.5
N$5
  Bottom 0.406: IC2.62 72.55,38.83 C7.2
N$6
  Bottom 0.406: Q1.1 68.2,69.34 | 65.29,69.34 65.15,69.34 | 65.29,69.34 C9.2 | Q1.1 68.22,69.34 65.29,69.34 | Q1.1 76.55,69.33 IC2.24
N$7
  Bottom 0.406: 68.2,64.52 Q1.2 68.22,64.52 | 65.51,64.52 65.41,64.52 | C8.2 65.51,64.52 | 65.51,64.52 68.2,64.52 | 68.2,64.52 68.22,64.52 | 68.22,64.52 75.75,64.52 IC2.23
N$8
  Bottom 0.813: IC1.2 114.2,8.81 D2.C 116.08,17.32 L1.P$1
N$9
  Bottom 0.406: IC2.58 75.75,31.81 arc-90 75.69,31.75 66.1,31.75 ADC.8 ADC.7
N$10
  Bottom 1.93: MPOWER.1 46.13,11.46 47.12,12.45 56.52,12.45 56.83,12.13 | POWER.1 57.3,11.66 56.83,12.13 | F1.1 67.11,11.63 66.17,12.57 57.28,12.57 56.83,12.13
N$11
  Bottom 0.406: IC2.57 76.55,31.11 68.71,31.11 arc90 68.64,31.05 ADC.10 ADC.9
N$12
  Bottom 0.406: IC6.14 26.16,69.15 26.16,59.44 18.16,59.44 18.16,25.91 14.8,25.91 COM1.2
N$13
  Bottom 0.406: IC6.13 25.53,70.42 25.53,60.33 17.4,60.33 17.4,28.74 COM1.3
N$14
  Bottom 0.406: IC2.56 77.35,30.49 arc-90 77.22,30.35 71.18,30.35 ADC.12 ADC.11
N$15
  Bottom 0.406: IC2.55 78.15,29.76 arc-90 78.11,29.72 73.72,29.72 ADC.14 ADC.13
N$16
  Bottom 0.813: JP2.1 39.12,11.56 34.7,11.56 CAN.4
N$17
  Bottom 0.406: IC6.1 22.23,66.61 C21.2
N$18
  Top 2: 20,-1 -1,-1 -1,20
N$19
  Bottom 0.406: GP2D120-2.3 GP2D120.3 69.22,22.48 69.6,22.86 75.82,22.86 76.26,23.3 ADC.15 ADC.16 78.95,27.88 IC2.54
N$20
  Bottom 0.406: IC2.45 87.65,46.72 87.76,46.61 87.76,44.45 88.27,43.94 89.66,43.94 IO.13 IO.14
N$21
  Bottom 0.406: IC5.4 27.69,26.68 27.69,23.11 27.94,22.86 34.67,22.86 36.2,21.34 43.69,21.34 43.69,25.65 51.44,25.65 51.47,25.69 IC4.2
N$22
  Bottom 0.406: ISP.9 R6.1
N$23
  Bottom 0.406: IC5.6 26.92,24.14 26.92,16.64 31.2,16.64 CAN.3 31.2,7.32 R20.1
N$24
  Bottom 0.406: IC2.46 86.8,45.92 87,45.72 87,41.66 87.25,41.4 89.66,41.4 IO.11 IO.12
N$25
  Bottom 0.406: R5.1 25.09,39.83 ISP.1
N$26
  Bottom 0.406: IC2.1 67.18,44.32 67.18,38.35 64.54,38.35 R3.1
N$27
  Top 2: 140,-1 161,-1 161,20
N$28
  Bottom 0.406: IC2.47 84.75,45.09 86.23,45.09 86.23,39.5 86.74,38.99 89.53,38.99 IO.9 IO.10
N$29
  Bottom 0.406: ISP.7 R4.1
N$30
  Bottom 0.406: IC6.4 20.57,70.42 20.57,69.6 19.43,69.6 19.43,69.72 C22.2
N$31
  Bottom 0.406: IC2.48 85.35,44.32 85.47,44.2 85.47,36.96 85.98,36.45 89.53,36.45 IO.7 IO.8
N$32
  Bottom 0.406: IC2.49 82.95,34.27 83.31,33.91 89.53,33.91 IO.5 IO.6
N$33
  Bottom 0.406: R5.2 39.37,39.83 39.37,40.01 | 39.37,40.01 JP1.4 | IC2.2 66.55,45.12 66.55,40.01 39.37,40.01
N$34
  Bottom 0.406: IC2.50 82.15,31.77 82.8,31.11 89.66,31.11 IO.3 IO.4
N$35
  Bottom 0.406: IC2.51 81.35,29.78 82.55,28.57 89.66,28.57 IO.1 IO.2
N$36
  Bottom 0.406: C22.1 19.43,71.42 19.43,71.69 IC6.5
N$37
  Bottom 0.406: IC6.3 24,69.15 24,62.36 22.23,62.36 C21.1
N$38
  Top 2: 20,101 -1,101 -1,80
N$39
  Top 2: 161,80 161,101 140,101
N$40
  Bottom 0.406: IC6.7 24.19,74.23 24.77,73.66 24.77,61.2 COM2.2
N$41
  Bottom 0.406: IC6.8 17.84,75.5 13.21,70.87 11.05,70.87 10.41,70.23 10.41,64.64 11.18,63.88 14.8,63.88 COM2.3
N$42
  Bottom 0.406: IC2.42 92.49,49.12 92.71,48.9 92.71,48.13 94.11,46.74 94.11,45.72 95.12,44.7 95.12,39.88 95.76,39.24 97.03,39.24 PORTC.15 PORTC.16
N$43
  Bottom 0.406: IC6.2 C19.1 19.18,67.88 19.18,67.94
N$44
  Bottom 0.406: R6.2 31.62,50 31.62,64.9 38.23,64.9 38.23,72.9 JP1.2 40.51,72.9 40.51,40.77 65.91,40.77 65.91,45.92 IC2.3
N$45
  Bottom 2: 140,-1 161,-1 161,20
N$46
  Bottom 0.406: C20.1 19.43,73.22 19.43,72.96 IC6.6
N$47
  Bottom 0.406: SRF05-2.2 SRF05.2 81.6,25.46 82.42,26.29 93.09,26.29 94.23,27.43 94.23,44.32 93.09,45.47 92.58,45.47 92.2,45.85 92.2,46.35 IO.16 | IC2.44 89.52,47.52 89.79,47.24 89.79,46.48 IO.15 IO.16 | IO.16 92.33,46.48
N$48
  Bottom 2: 20,101 -1,101 -1,80
N$49
  Bottom 0.813: JP2.2 41.66,12.72 F2.P$1
N$50
  Bottom 0.813: JP3.2 13.84,11.68 24.2,11.68 CAN.1
N$51
  Bottom 2: 161,80 161,101 140,101
N$52
  Bottom 0.406: IC2.17 62.44,58.12 ISP3.12 ISP3.11
N$53
  Bottom 0.406: Q3.1 38.28,32.44 | Q3.1 45.12,32.41 IC4.7 | C28.1 34.15,32.41 Q3.1
N$54
  Bottom 0.406: Q3.2 38.29,37.22 | Q3.2 41.27,37.24 41.27,39.12 43.85,39.12 IC4.8 | C29.1 33.79,37.24 Q3.2
N$55
  Bottom 2: 20,-1 -1,-1 -1,20
N$56
  Bottom 0.813: F1.2 89.53,6.81 89.53,12.57 90.04,13.08 D1.C 92.84,10.16 93.09,9.91 99.69,9.91 C14.+ 106.44,10.03 IC1.1
N$59
  Bottom 0.406: IC5.7 19.81,21.6 19.81,15.37 27.7,15.37 CAN.2 27.7,7.32 R20.2
N$60
  Bottom 0.406: IC2.15 62.38,55.52 ISP3.10 ISP3.9
N$61
  Bottom 0.406: ADC1.2 ADC1.1 77.35,65.02 IC2.25
N$62
  Bottom 0.406: ADC1.4 ADC1.3 82.04,63.75 78.15,63.75 IC2.26
N$63
  Bottom 0.406: ADC1.10 ADC1.9 89.66,61.34 80.64,61.34 arc90 80.55,61.24 IC2.29
N$64
  Bottom 0.406: ADC1.12 ADC1.11 92.2,60.58 81.41,60.58 arc90 81.35,60.52 IC2.30
N$65
  Bottom 0.406: ADC1.14 ADC1.13 94.74,59.94 82.17,59.94 82.17,58.12 IC2.31
N$66
  Bottom 0.406: ADC1.16 ADC1.15 97.28,59.51 97.08,59.31 82.93,59.31 82.95,59.29 IC2.32
N$67
  Bottom 0.406: IC2.41 93.34,49.92 93.47,49.78 93.47,48.64 94.87,47.24 94.87,46.1 95.89,45.09 95.89,42.55 96.52,41.91 PORTC.13 PORTC.14
N$68
  Bottom 0.406: IC2.40 93.94,50.72 94.23,50.42 94.23,49.15 95.76,47.62 95.76,46.35 96.77,45.34 96.9,45.34 97.16,45.09 PORTC.11 PORTC.12
N$69
  Bottom 0.406: IC2.39 94.41,51.52 95,50.93 95,49.53 96.39,48.13 96.9,48.13 97.16,47.88 PORTC.9 PORTC.10
N$70
  Bottom 0.406: IC2.38 94.88,52.32 95.76,51.44 95.76,50.16 96.39,49.53 PORTC.7 PORTC.8
N$71
  Bottom 0.406: IC2.37 96.11,53.12 PORTC.5 PORTC.6
N$72
  Bottom 0.406: IC2.36 96.46,53.92 PORTC.3 PORTC.4
N$73
  Bottom 0.406: IC2.35 92.94,54.72 95.38,57.15 PORTC.1 PORTC.2
RST  (via drill 1.2)
  Top 0.406: v42.42,53.09 37.85,53.09 37.47,52.7 v37.47,52.07
  Bottom 0.406: 51.69,59.05 51.65,59.05 R2.1 | IC2.20 73.35,59.31 56.13,59.31 56.13,53.21 53.98,53.21 53.98,45.34 51.47,45.34 IC4.17 51.47,54.61 47.24,54.61 | R2.1 arc-90 51.64,59.05 | R2.1 51.65,59.03 C6.2 47.24,59.03 47.24,54.61 | ISP.5 36.92,44.92 37.59,45.59 37.59,51.94 v37.47,52.07 | 47.24,54.61 42.8,54.61 42.42,54.23 v42.42,53.09
RXD
  Bottom 0.406: IC6.12 33.66,71.69 33.66,70.23 36.83,70.23 JP1.3
RXD1
  Bottom 0.406: IC2.27 78.99,58.12 78.99,62.87 82.42,62.87 ADC1.5 ADC1.6 84.58,75.56 38.61,75.56 38.61,75.5 IC6.9
SCK  (via drill 1.2)
  Top 0.406: v34.67,47.37 45.63,47.37 46.39,48.13 46.39,51.02 v46.35,51.05
  Bottom 0.406: IC2.11 66.42,52.32 66.42,50.93 63.5,48.01 63.5,44.7 ISP3.2 ISP3.1 57.91,44.7 57.91,42.29 46.39,42.29 IC4.13 | IC4.13 46.35,47.18 | R4.2 34.59,47.45 v34.67,47.37 | IC4.13 46.39,51.02 v46.35,51.05
TXD
  Bottom 0.406: IC6.11 36.83,72.96 JP1.1
TXD1  (via drill 1.2)
  Top 0.406: v82.68,73.79 v86.74,73.79
  Bottom 0.406: IC6.10 80.83,74.23 80.9,74.17 82.3,74.17 v82.68,73.79 | v86.74,73.79 87.12,73.41 ADC1.8 ADC1.7 87.12,62.48 86.74,62.1 79.88,62.1 79.75,61.97 IC2.28
VCC  (via drill 1.2)
  Top 0.406: v84.07,23.5 83.95,23.37 v78.74,23.37 56.9,23.37 56.39,23.88 56.39,33.27 56.64,33.53 | v49.53,33.53 56.64,33.53 | 56.64,33.53 58.67,33.53 59.05,33.91 v59.05,36.7 56.26,36.7 56.01,36.96 v56.01,66.8
  Bottom 0.406: 31.75,66.55 31.75,66.46 C23.1 31.79,66.55 31.75,66.55 | 31.75,66.61 31.75,66.55 | 30.23,66.61 30.23,66.67 | C5.2 53.98,57.28 53.98,57.27 | C5.2 53.98,57.27 | C5.2 54.01,57.28 | 53.98,57.16 R2.2 | 53.98,57.16 53.98,57.27 | 47.62,28.19 47.62,37.38 IC4.6 IC4.5 IC4.4 48.93,34.12 v49.53,33.53 | 53.98,57.16 54.01,57.16 54.01,54.48 | 54.01,54.48 55.12,54.48 55.12,59.94 55.24,60.07 74.17,60.07 74.17,58.12 | 54.01,54.48 52.74,54.48 IC4.18 | 74.17,58.12 IC2.21 | 74.17,44.83 74.17,58.12 | 74.17,44.83 70.95,44.83 IC2.64 70.95,41.27 69.09,41.27 68.71,40.89 68.71,38.1 67.78,37.17 67.78,36.96 | 74.17,44.83 80.52,44.83 80.55,44.8 IC2.52 | 67.82,36.66 C1.2 67.78,36.96 | SRF05-2.3 SRF05.3 84.64,20.7 | GP2D120-2.1 GP2D120.1 75.56,20.19 v78.74,23.37 | C15.+ 96.27,20.19 95.76,20.7 84.64,20.7 | 84.64,20.7 84.64,22.92 v84.07,23.5 | v59.05,36.7 59.1,36.66 R3.2 66.75,36.66 67.06,36.96 67.78,36.96 | v56.01,66.8 56.01,67.31 57.28,68.58 ISP1.7 | 37.72,24.14 38.59,24.14 F2.P$2
  Bottom 0.813: 30.23,66.61 31.75,66.61 | 30.23,66.61 IC6.16 | 38.61,28.19 33.4,28.19 32.13,29.46 22.55,29.46 ISP.2 19.3,39.84 19.3,58.55 30.23,58.55 30.23,66.61 | 59.94,72.39 ISP1.10 ISP1.8 | ISP1.4 ISP1.2 | ISP1.6 ISP1.4 | ISP1.8 ISP1.6 | ISP1.1 49.53,69.85 | ISP1.3 ISP1.1 | ISP1.5 ISP1.3 | ISP1.7 ISP1.5 | ISP1.7 ISP1.9 | ISP1.2 49.66,72.52 49.78,72.52 | ISP1.1 ISP1.2 | ISP1.3 ISP1.4 | ISP1.5 ISP1.6 | ISP1.7 57.28,69.72 | ISP1.7 ISP1.8 | IC5.3 37.72,24.14 37.72,24 | 38.61,28.19 F2.P$2 | 38.61,28.19 47.62,28.19 | IC1.4 112.09,5.41 112.78,6.1 116.59,6.1 118.87,8.38 118.87,20.7 106.05,20.7 103,17.65 L1.P$2 97.92,17.65 C15.+